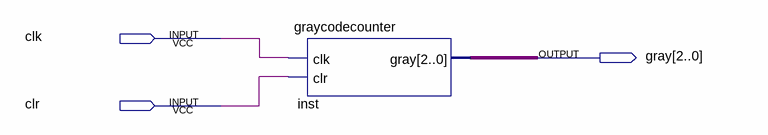
[diagram p0: schematic sheet]
// Quartus schematic MooreGrayCodeCounter.bdf as structural Verilog: 1 symbols, 3 pins
module MooreGrayCodeCounter (
  input  clk,
  input  clr,
  output [2:0] gray
);

  graycodecounter inst (.clk(clk), .clr(clr), .gray(gray));
endmodule
